# EAGLE design main_P2100 (EAGLE 9.6.2)
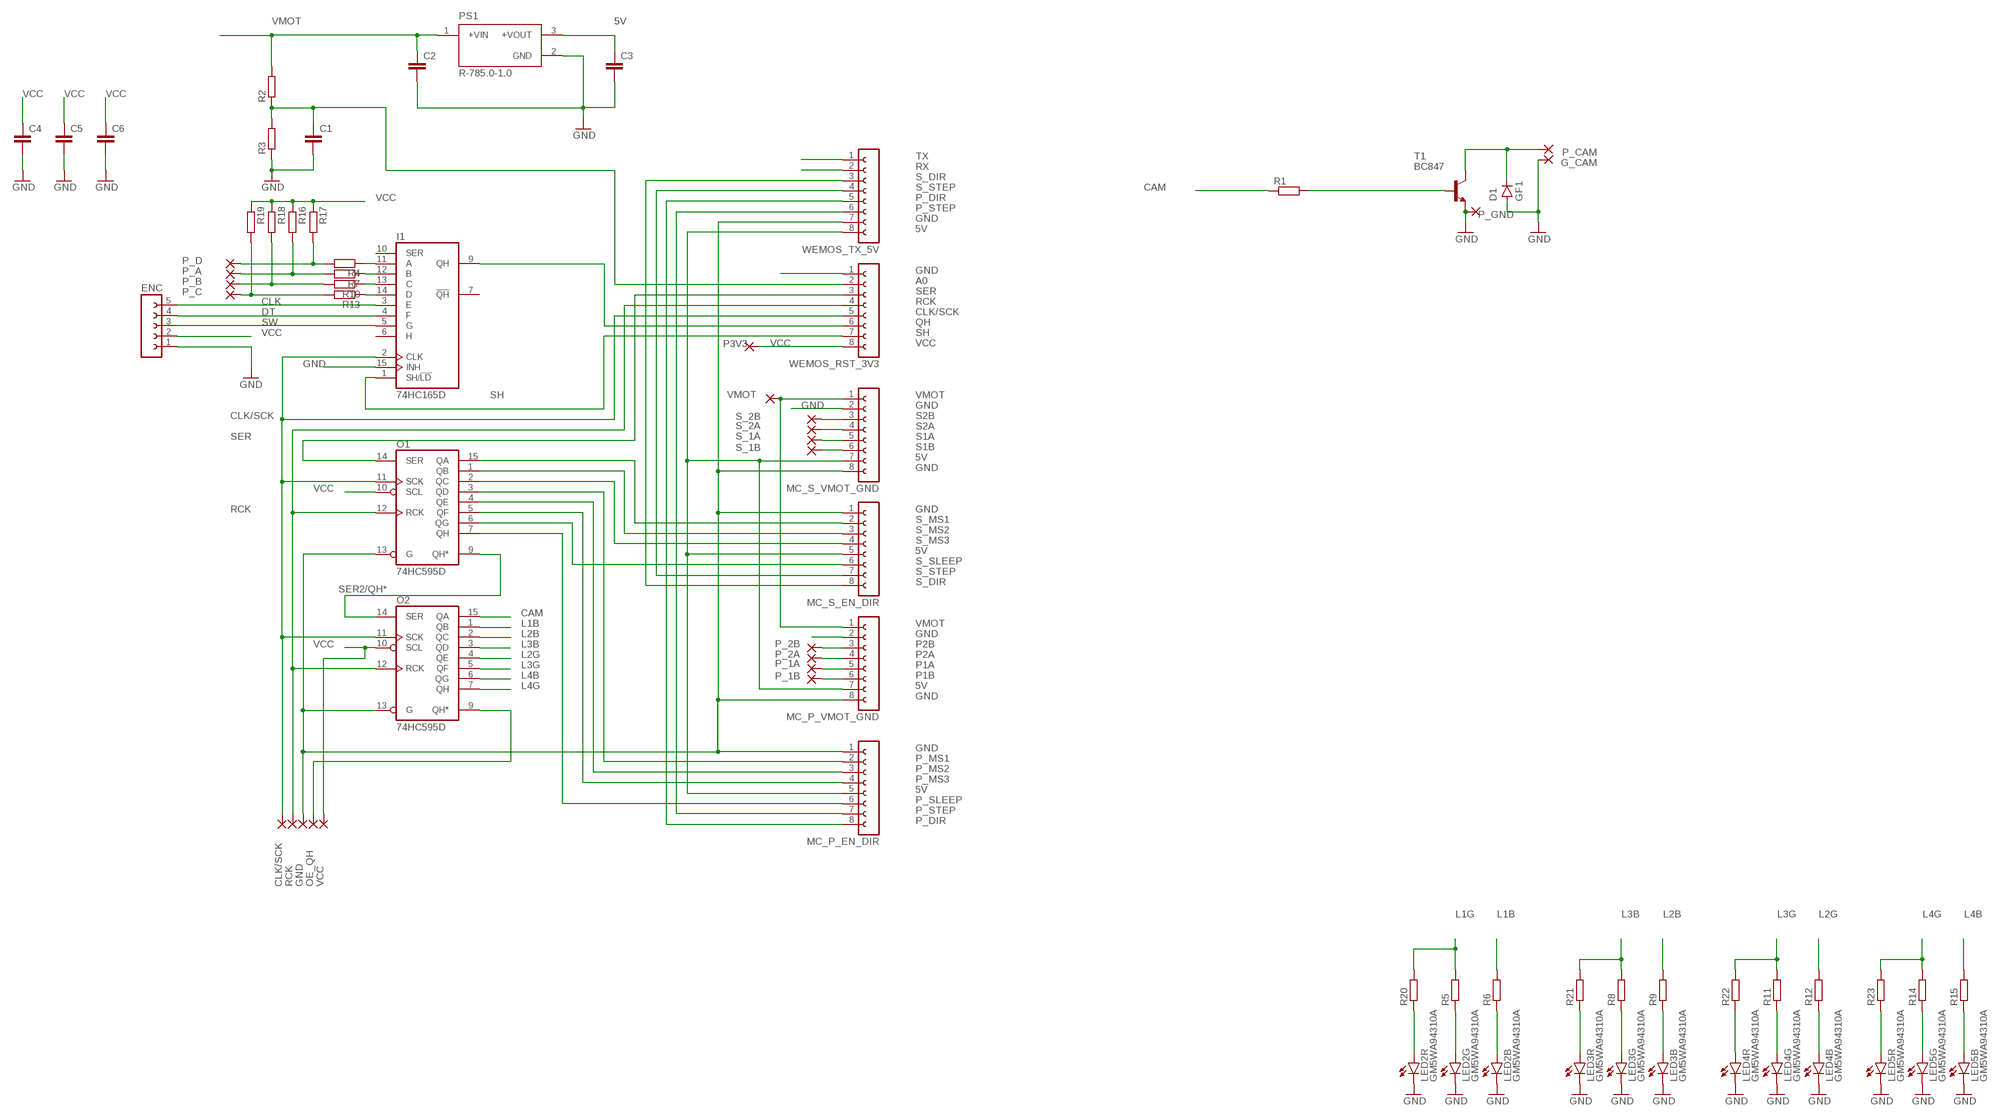
[diagram p0: schematic, sheet 1]

## Parts
C1  C-EUC0603  [C0603]
C2  C-EUC1206  [C1206]
C3  C-EUC1206  [C1206]
C4  C-EUC0603  [C0603]
C5  C-EUC0603  [C0603]
C6  C-EUC0603  [C0603]
D1  GF1  [SMA-DO214AC]
ENC  FE05-1  [FE05-1]
G_CAM  SMD5  [SMD2,54-5,08]
I1  74HC165D  [SO16]
LED2  GM5WA94310A  [GM5WA94310A]
LED3  GM5WA94310A  [GM5WA94310A]
LED4  GM5WA94310A  [GM5WA94310A]
LED5  GM5WA94310A  [GM5WA94310A]
MC_P_EN_DIR  FE08-1  [FE08]
MC_P_VMOT_GND  FE08-1  [FE08]
MC_S_EN_DIR  FE08-1  [FE08]
MC_S_VMOT_GND  FE08-1  [FE08]
O1  74HC595D  [SO16]
O2  74HC595D  [SO16]
P3V3  SMD5  [SMD2,54-5,08]
P_1A  SMD5  [SMD2,54-5,08]
P_1B  SMD5  [SMD2,54-5,08]
P_1B1  SMD5  [SMD2,54-5,08]
P_1B2  SMD5  [SMD2,54-5,08]
P_1B3  SMD5  [SMD2,54-5,08]
P_1B4  SMD5  [SMD2,54-5,08]
P_1B5  SMD5  [SMD2,54-5,08]
P_2A  SMD5  [SMD2,54-5,08]
P_2B  SMD5  [SMD2,54-5,08]
P_A  SMD5  [SMD2,54-5,08]
P_B  SMD5  [SMD2,54-5,08]
P_C  SMD5  [SMD2,54-5,08]
P_CAM  SMD5  [SMD2,54-5,08]
P_D  SMD5  [SMD2,54-5,08]
P_GND  SMD5  [SMD2,54-5,08]
PS1  R-785.0-1.0  [CONV_R-785.0-1.0]
R1  R-EU_R0603  [R0603]
R2  R-EU_R0603  [R0603]
R3  R-EU_R0603  [R0603]
R4  R-EU_R0603  [R0603]
R5  R-EU_R0603  [R0603]
R6  R-EU_R0603  [R0603]
R7  R-EU_R0603  [R0603]
R8  R-EU_R0603  [R0603]
R9  R-EU_R0603  [R0603]
R10  R-EU_R0603  [R0603]
R11  R-EU_R0603  [R0603]
R12  R-EU_R0603  [R0603]
R13  R-EU_R0603  [R0603]
R14  R-EU_R0603  [R0603]
R15  R-EU_R0603  [R0603]
R16  R-EU_R0603  [R0603]
R17  R-EU_R0603  [R0603]
R18  R-EU_R0603  [R0603]
R19  R-EU_R0603  [R0603]
R20  R-EU_R0603  [R0603]
R21  R-EU_R0603  [R0603]
R22  R-EU_R0603  [R0603]
R23  R-EU_R0603  [R0603]
S_1A  SMD5  [SMD2,54-5,08]
S_1B  SMD5  [SMD2,54-5,08]
S_2A  SMD5  [SMD2,54-5,08]
S_2B  SMD5  [SMD2,54-5,08]
T1  BC847  [SOT23]
VMOT  SMD5  [SMD2,54-5,08]
WEMOS_RST_3V3  FE08-1  [FE08]
WEMOS_TX_5V  FE08-1  [FE08]

## Nets
5V: C3.1 MC_P_EN_DIR.5 MC_P_VMOT_GND.7 MC_S_EN_DIR.5 MC_S_VMOT_GND.7 PS1.3(+VOUT) WEMOS_TX_5V.8
A0: C1.1 R2.1 R3.2 WEMOS_RST_3V3.2
CAM: O2.15(QA) R1.1
CLK: ENC.5 I1.3(E)
CLK/SCK: I1.2(CLK) O1.11(SCK) O2.11(SCK) P_1B1.1(P) WEMOS_RST_3V3.5
DT: ENC.4 I1.4(F)
GND: C1.2 C2.2 C3.2 C4.2 C5.2 C6.2 D1.A ENC.1 G_CAM.1(P) I1.15(INH) LED2.4(G:C) LED2.5(R:C) LED2.6(B:C) LED3.4(G:C) LED3.5(R:C) LED3.6(B:C) LED4.4(G:C) LED4.5(R:C) LED4.6(B:C) LED5.4(G:C) LED5.5(R:C) LED5.6(B:C) MC_P_EN_DIR.1 MC_P_VMOT_GND.2 MC_P_VMOT_GND.8 MC_S_EN_DIR.1 MC_S_VMOT_GND.2 MC_S_VMOT_GND.8 O1.13(G) O2.13(G) P_1B3.1(P) P_GND.1(P) PS1.2(GND) R3.1 T1.2(E) WEMOS_RST_3V3.1 WEMOS_TX_5V.7
L1B: O2.1(QB) R6.2
L1G: R5.2 R20.2
L2B: O2.2(QC) R9.2
L2G: O2.4(QE) R12.2
L3B: O2.3(QD) R8.2 R21.2
L3G: O2.5(QF) R11.2 R22.2
L4B: O2.6(QG) R15.2
L4G: O2.7(QH) R14.2 R23.2
N$1: R1.2 T1.1(B)
N$2: D1.K(C) P_CAM.1(P) T1.3(C)
N$4: LED2.3(G:A) R5.1
N$5: LED2.1(B:A) R6.1
N$22: P_D.1(P) R4.2 R17.2
N$23: LED3.3(G:A) R8.1
N$24: LED3.1(B:A) R9.1
N$25: P_A.1(P) R7.2 R16.2
N$26: LED4.3(G:A) R11.1
N$27: LED4.1(B:A) R12.1
N$28: P_B.1(P) R10.2 R18.2
N$29: LED5.3(G:A) R14.1
N$30: LED5.1(B:A) R15.1
N$31: P_C.1(P) R13.2 R19.2
N$32: LED2.2(R:A) R20.1
N$34: I1.14(D) R13.1
N$35: I1.13(C) R10.1
N$36: I1.12(B) R7.1
N$37: I1.11(A) R4.1
N$40: LED3.2(R:A) R21.1
N$41: LED4.2(R:A) R22.1
N$44: LED5.2(R:A) R23.1
OE_QH: O2.9(QH*) P_1B4.1(P)
P1A: MC_P_VMOT_GND.5 P_1A.1(P)
P1B: MC_P_VMOT_GND.6 P_1B.1(P)
P2A: MC_P_VMOT_GND.4 P_2A.1(P)
P2B: MC_P_VMOT_GND.3 P_2B.1(P)
P_DIR: MC_P_EN_DIR.8 WEMOS_TX_5V.5
P_MS1: MC_P_EN_DIR.2 O1.3(QD)
P_MS2: MC_P_EN_DIR.3 O1.4(QE)
P_MS3: MC_P_EN_DIR.4 O1.5(QF)
P_SLEEP: MC_P_EN_DIR.6 O1.7(QH)
P_STEP: MC_P_EN_DIR.7 WEMOS_TX_5V.6
QH: I1.9(QH) WEMOS_RST_3V3.6
RCK: O1.12(RCK) O2.12(RCK) P_1B2.1(P) WEMOS_RST_3V3.4
RX: WEMOS_TX_5V.2
S1A: MC_S_VMOT_GND.5 S_1A.1(P)
S1B: MC_S_VMOT_GND.6 S_1B.1(P)
S2A: MC_S_VMOT_GND.4 S_2A.1(P)
S2B: MC_S_VMOT_GND.3 S_2B.1(P)
S_DIR: MC_S_EN_DIR.8 WEMOS_TX_5V.3
S_MS1: MC_S_EN_DIR.2 O1.15(QA)
S_MS2: MC_S_EN_DIR.3 O1.1(QB)
S_MS3: MC_S_EN_DIR.4 O1.2(QC)
S_SLEEP: MC_S_EN_DIR.6 O1.6(QG)
S_STEP: MC_S_EN_DIR.7 WEMOS_TX_5V.4
SER: O1.14(SER) WEMOS_RST_3V3.3
SER2/QH*: O1.9(QH*) O2.14(SER)
SH: I1.1(SH/!LD) WEMOS_RST_3V3.7
SW: ENC.3 I1.5(G)
TX: WEMOS_TX_5V.1
VCC: C4.1 C5.1 C6.1 ENC.2 O1.10(SCL) O2.10(SCL) P3V3.1(P) P_1B5.1(P) R16.1 R17.1 R18.1 R19.1 WEMOS_RST_3V3.8
VMOT: C2.1 MC_P_VMOT_GND.1 MC_S_VMOT_GND.1 PS1.1(+VIN) R2.2 VMOT.1(P)
Unconnected: I1.6(H) I1.7(!QH) I1.10(SER)

## Power pins joined to a net without a drawn wire
GND: I1.8(GND) O1.8(GND) O2.8(GND)
VCC: I1.16(VCC) O1.16(VCC) O2.16(VCC)

## Library data of the parts
C1-C6 = rcl:C-EU: CAPACITOR, European symbol
D1 = diode:GF1: DIODE
ENC = con-lsta:FE05-1: FEMALE HEADER; OC_FARNELL: unknown; OC_NEWARK: unknown
G_CAM P3V3 P_1A P_1B P_1B1-P_1B5 P_2A P_2B P_A P_B P_C P_CAM P_D P_GND S_1A S_1B S_2A S_2B VMOT = wirepad:SMD5: SMD PAD
I1 = 74xx-eu:74*165: 8-bit parallel load SHIFT REGISTER
LED2-LED5 = led:GM5WA94310A: Chip LED RGB Source: http://document.sharpsma.com/files/GM5WA94310A_SS.pdf
MC_P_EN_DIR MC_P_VMOT_GND MC_S_EN_DIR MC_S_VMOT_GND WEMOS_RST_3V3 WEMOS_TX_5V = con-lsta:FE08-1: FEMALE HEADER; OC_FARNELL: unknown; OC_NEWARK: unknown
O1 O2 = 74xx-eu:74*595: 8-bit SHIFT REGISTER, output latch
PS1 = R-785.0-1.0:R-785.0-1.0: 1.0 Amp SIP3 Single Output; AVAILABILITY: Unavailable; DESCRIPTION: 1A DC/DC-Converter 'INNOLINE' SIP3 reg; MF: Recom Power; MP: R-785.0-1.0; PACKAGE: SIP-3 Recom Power; PRICE: None
R1-R23 = rcl:R-EU_: RESISTOR, European symbol; SPICEPREFIX: R
T1 = transistor:BC847: NPN TRANSISTOR

## Board
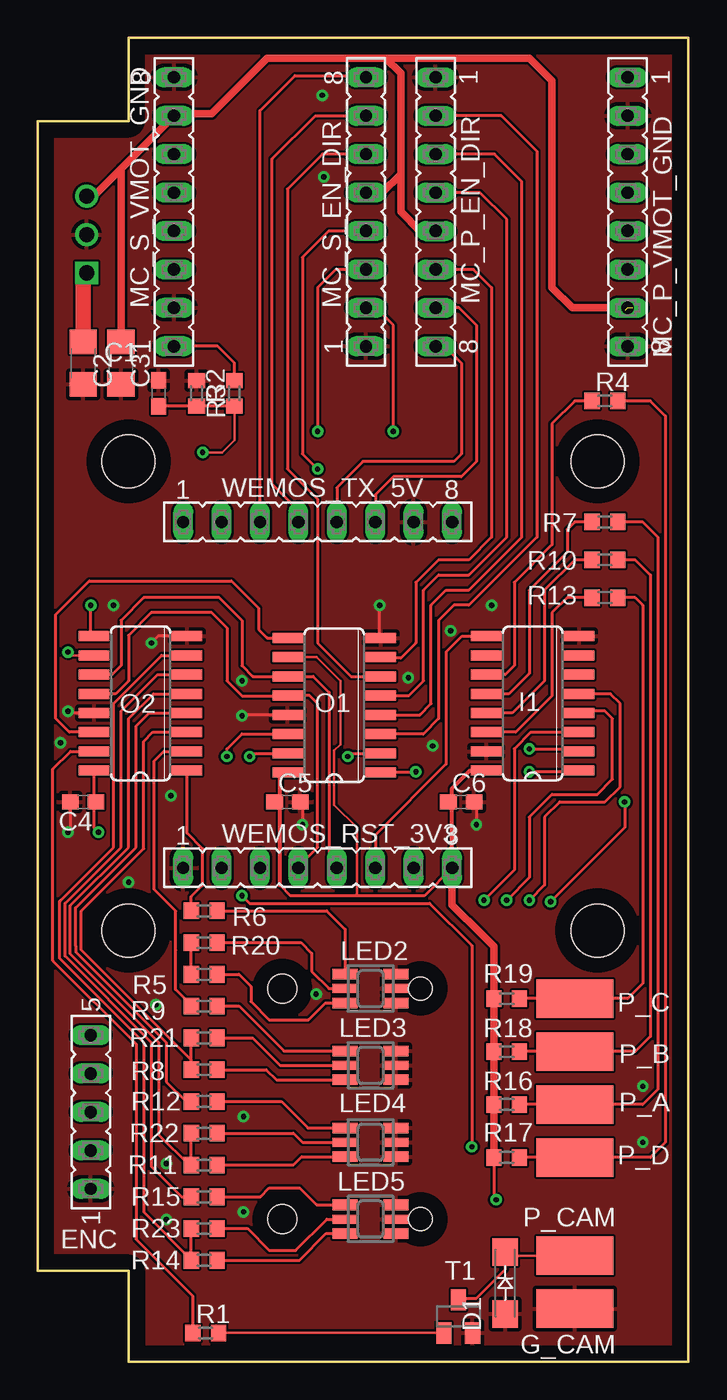
[diagram p1: board, top side]
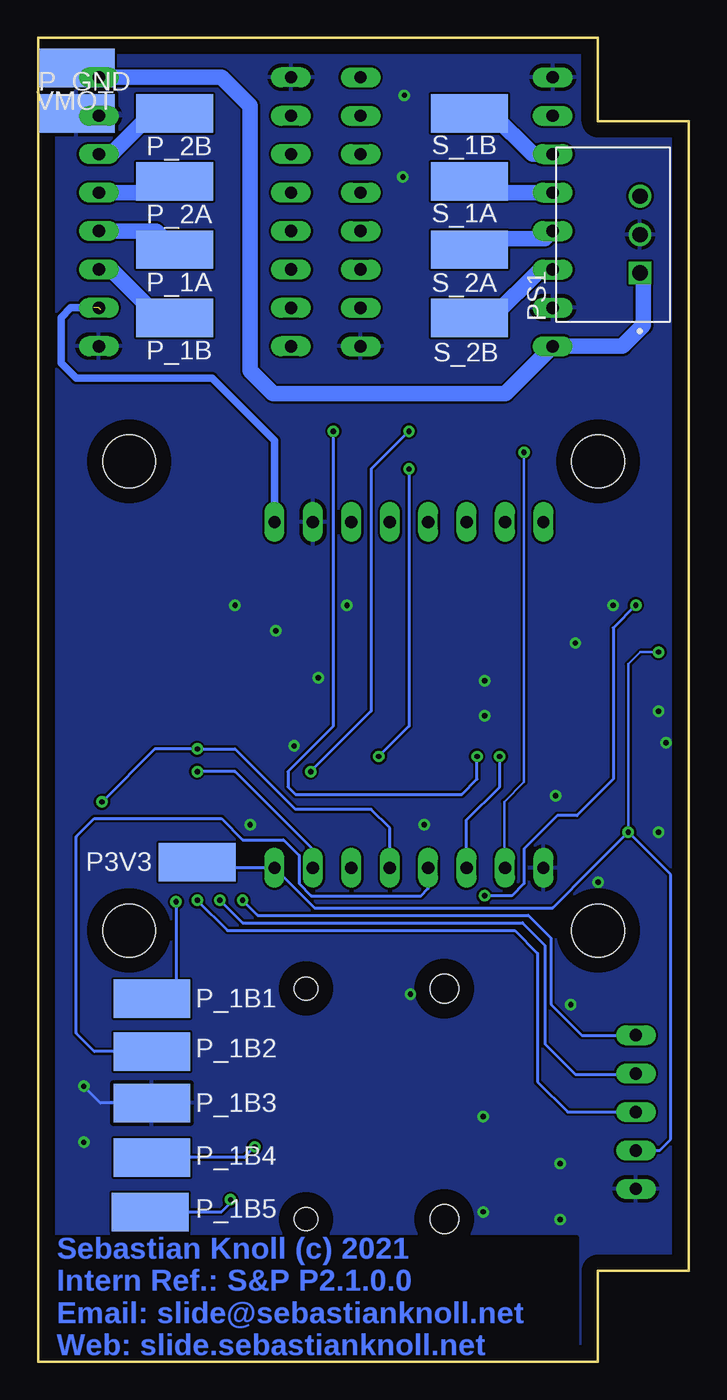
[diagram p2: board, bottom side, seen from below]

Size 43 x 87.5 mm. Coordinates in mm from the lower left corner, seen from the top.
Outline: 6,6 0,6 0,82 6,82 6,87.5 43,87.5 43,0 6,0 6,6
Copper layers (1*16): Top 0.035mm / dielectric 1.5mm / Bottom 0.035mm
Design rules "default *": minimum track width 6mil, minimum drill 0.2mm, track to track 6mil, track to pad 6mil, pad to pad 6mil, via to via 6mil, smd to smd 6mil, copper to edge 40mil, drill to drill 6mil, minimum pad ring 10mil, minimum via ring 8mil, stop-mask expansion 4mil, vias tented up to drill 0mil, thermal gap 10mil
Holes 3.5 mm at 6,28.5 37,28.5 6,59.5 37,59.5
Holes 1.53 mm at 25.3,9.42 25.3,24.66
Holes 1.9 mm at 16.16,24.66 16.16,9.42

### Footprints (pad centres in the part's own frame; a part is rotated, then mirrored left to right if it is on the bottom)
C0603 = smd 1.1 x 1: 1 -0.85,0; 2 0.85,0
C1206 = smd 1.6 x 1.8: 1 -1.4,0; 2 1.4,0
SMA-DO214AC = smd 1.8 x 1.7: A -2.05,0; K 2.05,0
FE05-1 = drill 0.813 long: 1 -5.08,0; 2 -2.54,0; 3 0,0; 4 2.54,0; 5 5.08,0
SMD2,54-5,08 = smd 2.54 x 5.08: 1 0,0
SO16 = smd 0.66 x 2.032: 1 -4.445,-3.073; 2 -3.175,-3.073; 3 -1.905,-3.073; 4 -0.635,-3.073; 5 0.635,-3.073; 6 1.905,-3.073; 7 3.175,-3.073; 8 4.445,-3.073; 9 4.445,3.073; 10 3.175,3.073; 11 1.905,3.073; 12 0.635,3.073; 13 -0.635,3.073; 14 -1.905,3.073; 15 -3.175,3.073; 16 -4.445,3.073
GM5WA94310A = smd 0.7 x 1.65: 1 -0.95,-1.675; 3 0.95,-1.675; 4 0.95,1.675; 6 -0.95,1.675 | smd 0.6 x 1.65: 2 0,-1.675; 5 0,1.675
FE08 = drill 0.813 long: 1 -8.89,0; 2 -6.35,0; 3 -3.81,0; 4 -1.27,0; 5 1.27,0; 6 3.81,0; 7 6.35,0; 8 8.89,0
CONV_R-785.0-1.0 = drill 1 square: 1 -2.54,-1.775 | drill 1: 2 0,-1.775; 3 2.54,-1.775
R0603 = smd 1 x 1.1: 1 -0.85,0; 2 0.85,0
SOT23 = smd 1 x 1.4: 1 -0.95,-1.1; 2 0.95,-1.1; 3 0,1.1

### Placement (x,y rotation side)
C1  8,64 90 top
C2  3,66 270 top
C3  5.5,66 270 top
C4  3,37 180 top
C5  16.5,37 0 top
C6  28,37 0 top
D1  30.9,5.2 90 top
ENC  3.5,16.5 90 top
G_CAM  35.5,3.5 90 top
I1  32.72,43.51 90 top
LED2  22,24.66 270 top
LED3  22,19.58 270 top
LED4  22,14.5 270 top
LED5  22,9.42 270 top
MC_P_EN_DIR  26.3,76 270 top
MC_P_VMOT_GND  39,76 270 top
MC_S_EN_DIR  21.7,76 90 top
MC_S_VMOT_GND  9,76 90 top
O1  19.6,43.39 90 top
O2  6.79,43.51 90 top
P3V3  32.5,33 90 bottom
P_1A  34,73.5 90 bottom
P_1B  34,69 90 bottom
P_1B1  35.5,24 270 bottom
P_1B2  35.5,20.5 270 bottom
P_1B3  35.5,17.1 270 bottom
P_1B4  35.5,13.5 270 bottom
P_1B5  35.6,9.9 270 bottom
P_2A  34,78 90 bottom
P_2B  34,82.5 90 bottom
P_A  35.5,17 90 top
P_B  35.5,20.5 90 top
P_C  35.5,24 90 top
P_CAM  35.5,7 270 top
P_D  35.5,13.5 90 top
P_GND  40.5,82.5 270 bottom
PS1  5,74.5 90 bottom
R1  11.1,1.9 0 top
R2  13,64 90 top
R3  10.5,64 270 top
R4  37.5,63.5 0 top
R5  11,25.6 180 top
R6  11,29.8 180 top
R7  37.5,55.5 0 top
R8  11,19.3 180 top
R9  11,23.5 180 top
R10  37.5,53 0 top
R11  11,13 180 top
R12  11,17.2 180 top
R13  37.5,50.5 0 top
R14  11,6.7 180 top
R15  11,10.9 180 top
R16  31,17 0 top
R17  31,13.5 0 top
R18  31,20.5 0 top
R19  31,24 0 top
R20  11,27.7 180 top
R21  11,21.4 180 top
R22  11,15.1 180 top
R23  11,8.8 180 top
S_1A  14.5,78 270 bottom
S_1B  14.5,82.5 270 bottom
S_2A  14.5,73.5 270 bottom
S_2B  14.5,69 270 bottom
T1  27.8,3 0 top
VMOT  40.5,85.5 90 bottom
WEMOS_RST_3V3  18.5,32.64 0 top
WEMOS_TX_5V  18.5,55.5 0 top

### Tracks (layer width: path | path; a pad name or v marks a point on that pad's centre or on a via)
5V  (2 unrouted)
  Top 0.508: 23,86.15 24,85.15 24,78.5 | 24,78.5 22.77,77.27 MC_S_EN_DIR.5 | 23,86.15 15.15,86.15 11.5,82.5 9.15,82.5 MC_S_VMOT_GND.7 5.5,78.85 | MC_P_VMOT_GND.7 35.35,69.65 34,71 34,84.65 32.5,86.15 23,86.15 | MC_P_EN_DIR.5 25.27,74.73 24,76 24,78.5 | 5.28,67.08 C3.1 5.5,78.85 | 5.5,78.85 3.69,77.04 PS1.3
  Bottom 0.305: 38.85,69.5 38,69.5 | 39.35,69.65 39.5,69.5 40,69.5
  Bottom 0.508: WEMOS_TX_5V.8 27.39,60.89 31.5,65 40.5,65 41.5,66 41.5,69 40.85,69.65 MC_P_VMOT_GND.7
A0  (via drill 0.35)
  Top 0.152: R2.1 13,60.9 12.2,60.1 v10.9,60.1
  Top 0.2: R2.1 R3.2 C1.1
  Bottom 0.152: v10.9,60.1 10.9,38.3 12.2,37 12.2,32.69 WEMOS_RST_3V3.2
CAM
  Top 0.2: R1.1 10.25,4.35 6.5,8.1 6.5,21 1,26.5 1,39.17 2.17,40.34 O2.15
CLK  (via drill 0.35)
  Top 0.2: I1.3 32.6,41.6 31.5,40.5 31.5,32.5 v29.5,30.5
  Bottom 0.2: v29.5,30.5 28.5,29.5 10.62,29.5 9.12,28 9.12,23.62 7.08,21.58 ENC.5
CLK/SCK  (via drill 0.35)
  Top 0.2: WEMOS_RST_3V3.5 19.27,33.14 19.27,44.23 18.2,45.3 O1.11 14.2,45.3 13.5,46 13.5,49 12,50.5 7,50.5 5.5,49 5.5,46 4.91,45.41 O2.11 | v32.5,40.5 35,40.5 | 35,40.5 35.63,40.5 | v38.8,37 38.8,35.3 v33.9,30.4 | I1.2 35.16,40.34 35,40.5
  Bottom 0.2: WEMOS_RST_3V3.5 19.77,35.27 21,36.5 26,36.5 30,40.5 v32.5,40.5 35.3,40.5 v38.8,37 | v33.9,30.4 33.9,24 P_1B1.1
DT  (via drill 0.35)
  Top 0.2: I1.4 35.92,43 37.5,43 38,42.5 38,38.5 37,37.5 34,37.5 32.5,36 32.5,32 v31,30.5
  Bottom 0.2: v31,30.5 29.5,29 11,29 9.5,27.5 9.5,21 7.5,19 3.54,19 ENC.4
GND  (via drill 0.35)
  Top 0.2: O2.8 7.96,47.95 v7.5,47.5 | O2.13 2.12,42.88 v2,43 | C4.2 2.15,35.15 v2,35 | O1.13 13.55,42.76 v13.5,42.7 | O1.8 22.6,47.91 v22.6,50 | C5.2 17.5,36.85 v17.5,35.5 | C6.2 29,36.85 v29,35.5
  Bottom 0.2: P_GND.1 39.15,82.5 MC_P_VMOT_GND.2 | P_1B3.1 38.9,17.1 v40,18.2
  other vias: 8.8,37.4 5,50 30,50 24.5,45.2 26.1,40.7 7.8,23.6 13.6,16.2 8.5,13.1 8.5,9.4 13.6,9.9 40,14.5 18.8,83.7 18.9,78.3 27.3,48.3 13.5,45 1.5,40.9 6,31.7 18.4,24.3
  pour Bottom: 25,-5 10,-5 -5,10 -5,85 5,95 45,95 45,-5
  pour Top: 25,-5 10,-5 -5,10 -5,85 5,95 50,95 50,0 45,-5
L1B
  Top 0.2: R6.2 10.15,30.75 10.9,31.5 10.9,33.9 9.86,34.94 O2.1
L1G
  Top 0.2: R5.2 R20.2
L2B
  Top 0.2: O2.2 8.34,40.34 7.7,39.7 7.7,31.2 9.12,29.79 9.12,27.21 9.1,27.19 9.1,24.6 9.9,23.8 9.9,23.75 R9.2
L2G
  Top 0.2: O2.4 7.38,42.88 6.5,42 6.5,34 2.5,30 2.5,27.5 2.53,27.47 2.53,27.06 8.5,21.09 8.5,18.5 9.8,17.2 R12.2
L3B
  Top 0.2: O2.3 7.61,41.6 7,41 7,33.91 2.88,29.79 2.88,27.21 10.15,19.94 R8.2 R21.2
L3G
  Top 0.2: O2.5 7.64,44.15 6,42.5 6,34 2.15,30.15 2.15,26.95 8,21.1 8,15 10,13 R11.2 R22.2
L4B
  Top 0.2: O2.6 7.91,45.41 5.5,43 5.5,34 1.79,30.3 1.79,26.8 7.5,21.1 7.5,12.9 9.5,10.9 R15.2
L4G
  Top 0.2: O2.7 8.19,46.69 5,43.5 5,34 1.5,30.5 1.44,30.44 1.44,26.66 7,21.1 7,9.9 10.15,6.75 R14.2 R23.2
N$1
  Top 0.152: T1.1 R1.2
N$2
  Top 0.152: P_CAM.1 31.15,7 D1.K
  Top 0.2: T1.3 27.9,4.2 29,4.2 30.9,6.1 D1.K
N$4
  Top 0.2: R5.1 13.29,25.6 14.09,24.8 14.09,23.8 15.3,22.59 17.89,22.59 19.01,23.71 LED2.3
N$5
  Top 0.2: R6.1 19.1,29.8 20.32,28.58 LED2.1
N$22
  Top 0.2: R4.2 40.5,63.5 41.5,62.5 41.5,14.5 40.5,13.5 P_D.1 35,13.5 R17.2
N$23
  Top 0.2: R8.1 15.1,19.3 15.77,18.63 LED3.3
N$24
  Top 0.2: R9.1 13.3,23.5 16.27,20.53 LED3.1
N$25
  Top 0.2: R7.2 40,55.5 41,54.5 41,18 40,17 P_A.1 R16.2
N$26
  Top 0.2: R11.1 16.9,13 17.45,13.55 LED4.3
N$27
  Top 0.2: R12.1 16.1,17.2 17.85,15.45 LED4.1
N$28
  Top 0.2: R10.2 39.5,53 40.5,52 40.5,21.5 39.5,20.5 P_B.1 35,20.5 R18.2
N$29
  Top 0.2: R14.1 17.3,6.7 19.07,8.47 LED5.3
N$30
  Top 0.2: R15.1 14.72,10.9 15.3,11.49 17.31,11.49 18.43,10.37 LED5.1
N$31
  Top 0.2: R13.2 39.5,50.5 40,50 40,25 39,24 P_C.1 35,24 R19.2
N$32
  Top 0.2: R20.1 17.4,27.7 18.1,27 18.1,25.8 19.24,24.66 LED2.2
N$34
  Top 0.2: R13.1 35,50.5 34,49.5 34,44 31.6,41.6 I1.14
N$35
  Top 0.2: R10.1 35.5,53 33.5,51 33.5,45 31.38,42.88 I1.13
N$36
  Top 0.2: R7.1 35.5,55.5 35,55 35,53.5 32.5,51 32.5,45.5 31.15,44.15 I1.12
N$37
  Top 0.2: R4.1 35.5,63.5 34,62 34,54 31.5,51.5 31.5,46 30.91,45.41 I1.11
N$40
  Top 0.2: R21.1 14.2,21.4 16.02,19.58 LED3.2
N$41
  Top 0.2: R22.1 16.9,15.1 17.5,14.5 LED4.2
N$44
  Top 0.2: R23.1 13.86,8.8 15.3,7.35 17.05,7.35 19.12,9.42 LED5.2
OE_QH  (via drill 0.35)
  Top 0.2: O2.9 3.5,48.17 v3.5,50 | v13.5,30.8 14,30.3 25.9,30.3 28.7,27.5 v28.7,14.2
  Bottom 0.2: v3.5,50 5,48.5 5,38.5 7.4,36.1 8.7,36.1 10.9,33.9 10.9,31.6 11.7,30.8 v13.5,30.8 | v28.7,14.2 29.4,13.5 P_1B4.1
P1A
  Bottom 1.016: P_1A.1 35.23,74.73 MC_P_VMOT_GND.5
P1B
  Bottom 1.016: P_1B.1 35.5,69 35.5,69.5 38.19,72.19 MC_P_VMOT_GND.6
P2A
  Bottom 1.016: P_2A.1 34.73,77.27 MC_P_VMOT_GND.4
P2B
  Bottom 1.016: P_2B.1 35.5,82.5 38.19,79.81 MC_P_VMOT_GND.3
P_DIR
  Top 0.2: MC_P_EN_DIR.8 26.89,67.11 28,66 28,60 27.5,59.5 21.5,59.5 19.77,57.77 WEMOS_TX_5V.5
P_MS1
  Top 0.2: MC_P_EN_DIR.2 30.65,82.35 33,80 33,54.5 28.5,50 27.5,50 26.5,49 26.5,42.5 25.48,41.48 O1.3
P_MS2
  Top 0.2: O1.4 25.25,42.76 26,43.5 26,50 27,51 28.5,51 32,54.5 32,78 30.19,79.81 MC_P_EN_DIR.3
P_MS3
  Top 0.2: O1.5 24.52,44.02 25.5,45 25.5,51 26.5,52 28.5,52 31,54.5 31,75.5 29.23,77.27 MC_P_EN_DIR.4
P_SLEEP
  Top 0.2: 22.74,46.5 24,46.5 25,47.5 25,51.5 26.5,53 28.5,53 30,54.5 30,71 28.81,72.19 MC_P_EN_DIR.6
  Top 0.508: 22.74,46.5 O1.7
P_STEP
  Top 0.2: MC_P_EN_DIR.7 27.85,69.65 29,68.5 29,59.5 28,58.5 23.5,58.5 22.31,57.31 WEMOS_TX_5V.6
QH
  Top 0.2: I1.9 28.05,47.95 27,46.91 27,39.5 22.31,34.81 WEMOS_RST_3V3.6
RCK
  Top 0.2: WEMOS_RST_3V3.4 17.23,32.73 18.5,34 18.5,43.5 17.98,44.02 O1.12 16.5,44 13.5,44 12.5,45 12.5,48.5 11.5,49.5 7.5,49.5 6,48 6,45 5.14,44.15 O2.12
  Bottom 0.2: P_1B2.1 39.3,20.5 40.5,21.7 40.5,34.7 39.3,35.9 30.9,35.9 29.5,34.5 26.8,34.5 25.76,33.46 25.76,31.6 24.96,30.8 17.7,30.8 17.23,31.27 WEMOS_RST_3V3.4
S1A
  Bottom 1.016: MC_S_VMOT_GND.5 13.27,77.27 14,78 S_1A.1
S1B
  Bottom 1.016: MC_S_VMOT_GND.6 10.31,79.81 13,82.5 S_1B.1
S2A
  Bottom 1.016: MC_S_VMOT_GND.4 9.5,74.23 13.77,74.23 S_2A.1
S2B
  Bottom 1.016: S_2B.1 13,69 9.81,72.19 MC_S_VMOT_GND.3
S_DIR
  Top 0.2: WEMOS_TX_5V.3 14.69,82.69 17,85 21.59,85 MC_S_EN_DIR.8
S_MS1  (via drill 0.35)
  Top 0.2: v14,40 14.21,40.22 O1.15 | v23.5,61.5 23.5,68.5 22.35,69.65 MC_S_EN_DIR.2
  Bottom 0.2: v14,40 14,38.5 15,37.5 26,37.5 26.5,38 26.5,39 23.5,42 v23.5,61.5
S_MS2  (via drill 0.35)
  Top 0.2: MC_S_EN_DIR.3 19.69,72.19 18.5,71 v18.5,61.5 | v25,39 24.95,38.95 O1.1
  Bottom 0.2: v18.5,61.5 21,59 21,43 v25,39
S_MS3  (via drill 0.35)
  Top 0.2: MC_S_EN_DIR.4 19.23,74.73 17.5,73 17.5,60 v18.5,59 | v20.5,40 20.71,40.22 O1.2
  Bottom 0.2: v18.5,59 18.5,42 v20.5,40
S_SLEEP
  Top 0.2: MC_S_EN_DIR.6 18.81,79.81 16.5,77.5 16.5,59 18.5,57 18.5,47.5 20.7,45.3 O1.6
S_STEP
  Top 0.2: WEMOS_TX_5V.4 17.23,56.27 15.5,58 15.5,79.5 18.35,82.35 MC_S_EN_DIR.7
SER  (via drill 0.35)
  Top 0.2: v12.5,40 12.5,40.5 13.5,41.5 16.51,41.5 O1.14
  Bottom 0.2: WEMOS_RST_3V3.3 14.69,35.81 12.5,38 v12.5,40
SER2/QH*
  Top 0.2: O2.14 2.09,41.6 1.19,42.5 1.19,49.39 3.4,51.6 12.8,51.6 14.6,49.8 14.6,48.4 15.16,47.84 O1.9
SH  (via drill 0.35)
  Top 0.2: v32.5,39 35.73,39
  Top 0.508: I1.1 35.73,39
  Bottom 0.2: v32.5,39 30,39 24.85,33.85 WEMOS_RST_3V3.7
SW  (via drill 0.35)
  Top 0.2: I1.5 37.85,44.15 38.5,43.5 38.5,38 37.5,37 34.5,37 33.5,36 33.5,31.5 v32.5,30.5
  Bottom 0.2: v32.5,30.5 30.5,28.5 11.5,28.5 10,27 10,18.5 8,16.5 ENC.3
VCC  (via drill 0.35)
  Top 0.152: O1.10 18.43,46.56 20,45 20,40.8 19.6,40.4 19.6,36.8 21.1,35.3 21.1,30.9 21,30.8 | O2.10 2.12,46.69 2,46.8 v2,46.9
  Top 0.2: v4,35 3.72,35.28 3.72,37 | 3.72,37 O2.16 | C4.1 3.72,37 | C5.1 16,36.65 16,35 | C6.1 27.39,37 | WEMOS_RST_3V3.8 25.55,30.8 21,30.8 16.7,30.8 16,31.5 | R17.1 30.15,10.85 v30.3,10.7
  Top 0.254: 16,31.5 16,35 16,39 16.47,39 O1.16 | WEMOS_RST_3V3.8 27.39,32.8 27.39,37 27.39,37.89 28.56,39.06 I1.16
  Top 0.508: R17.1 R16.1 R18.1 R19.1 30.15,27.45 29.4,28.2 29.38,28.2 27.39,30.19 27.39,32.8
  Bottom 0.152: v2,46.9 3.2,46.9 4,46.1 v4,35
  Bottom 0.2: P3V3.1 32.14,32.64 WEMOS_RST_3V3.8 24.75,30 9,30 6.36,32.64 v4,35 1.19,32.19 1.19,14.7 1.93,13.96 ENC.2 | P_1B5.1 30.9,9.9 30.2,10.6 v30.3,10.7
VMOT
  Top 0.2: R2.2 13,66 11.89,67.11 MC_S_VMOT_GND.1
  Top 1.016: C2.1 3,71.73 PS1.1
  Bottom 0.2: VMOT.1 39.89,84.89 MC_P_VMOT_GND.1
  Bottom 1.016: MC_P_VMOT_GND.1 30.89,84.89 29,83 29,70 29,65.5 27.5,64 12.11,64 MC_S_VMOT_GND.1 4.39,67.11 3,68.5 3,71.73 PS1.1

### Text on the board
Bottom: Sebastian Knoll (c) 2021 / Intern Ref.: S&P P2.1.0.0 / Email: slide@sebastianknoll.net / Web: slide.sebastianknoll.net